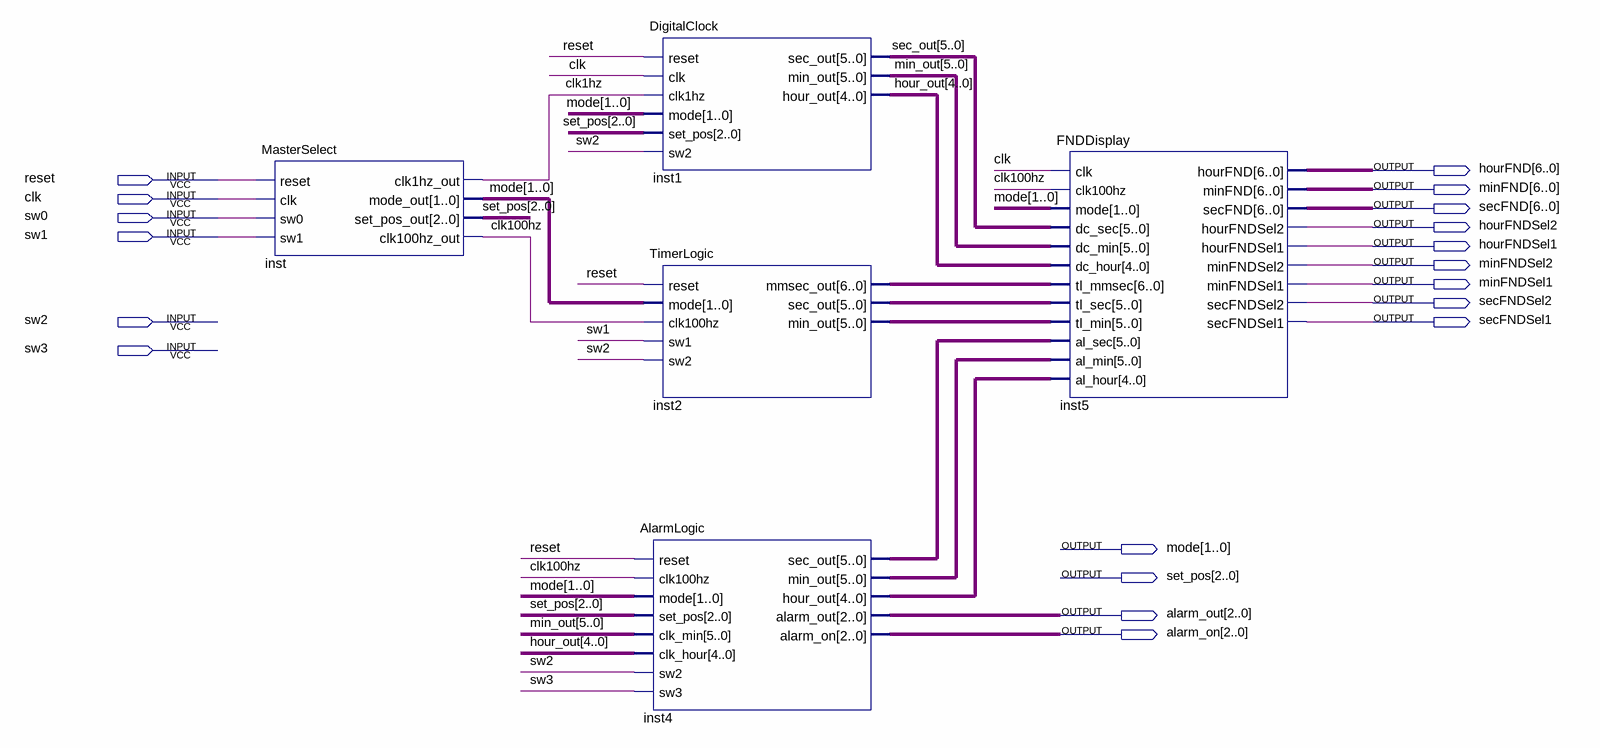
[diagram p0: schematic sheet]
// Quartus schematic DigitalWatch.bdf as structural Verilog: 5 symbols, 19 pins
module DigitalWatch (
  input  reset,
  input  clk,
  input  sw0,
  input  sw1,
  input  sw2,
  input  sw3,
  output [6:0] hourFND,
  output [6:0] minFND,
  output [6:0] secFND,
  output hourFNDSel2,
  output hourFNDSel1,
  output minFNDSel2,
  output minFNDSel1,
  output secFNDSel2,
  output secFNDSel1,
  output [1:0] mode,
  output [2:0] set_pos,
  output [2:0] alarm_out,
  output [2:0] alarm_on
);

  wire clk1hz, clk100hz;
  wire [4:0] hour_out, inst4_hour_out;
  wire [5:0] inst2_min_out, inst2_sec_out, inst4_min_out, inst4_sec_out, min_out, sec_out;
  wire [6:0] inst2_mmsec_out;

  MasterSelect inst (
    .reset(reset), .clk(clk), .sw0(sw0), .sw1(sw1), .clk1hz_out(clk1hz), .mode_out(mode),
    .set_pos_out(set_pos), .clk100hz_out(clk100hz));
  AlarmLogic inst4 (
    .reset(reset), .clk100hz(clk100hz), .mode(mode), .set_pos(set_pos), .clk_min(min_out),
    .clk_hour(hour_out), .sw2(sw2), .sw3(sw3), .sec_out(inst4_sec_out), .min_out(inst4_min_out),
    .hour_out(inst4_hour_out), .alarm_out(alarm_out), .alarm_on(alarm_on));
  DigitalClock inst1 (
    .reset(reset), .clk(clk), .clk1hz(clk1hz), .mode(mode), .set_pos(set_pos), .sw2(sw2), .sec_out(sec_out),
    .min_out(min_out), .hour_out(hour_out));
  TimerLogic inst2 (
    .reset(reset), .mode(mode), .clk100hz(clk100hz), .sw1(sw1), .sw2(sw2), .mmsec_out(inst2_mmsec_out),
    .sec_out(inst2_sec_out), .min_out(inst2_min_out));
  FNDDisplay inst5 (
    .clk(clk), .clk100hz(clk100hz), .mode(mode), .dc_sec(sec_out), .dc_min(min_out), .dc_hour(hour_out),
    .tl_mmsec(inst2_mmsec_out), .tl_sec(inst2_sec_out), .tl_min(inst2_min_out), .al_sec(inst4_sec_out),
    .al_min(inst4_min_out), .al_hour(inst4_hour_out), .hourFND(hourFND), .minFND(minFND), .secFND(secFND),
    .hourFNDSel2(hourFNDSel2), .hourFNDSel1(hourFNDSel1), .minFNDSel2(minFNDSel2), .minFNDSel1(minFNDSel1),
    .secFNDSel2(secFNDSel2), .secFNDSel1(secFNDSel1));
endmodule
